# Altium schematic sheet pocopin.SchDoc
size A4
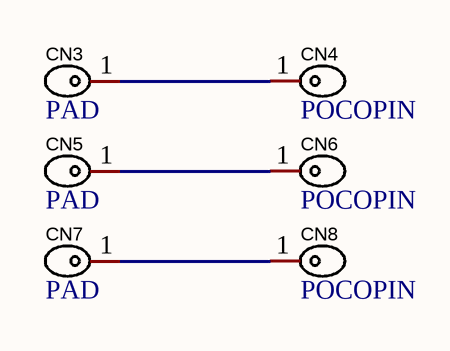
[diagram p0: pocopin.SchDoc]

## Parts
CN3  PAD  [PAD]
CN4  POCOPIN  [pocopin焊盘]
CN5  PAD  [PAD]
CN6  POCOPIN  [pocopin焊盘]
CN7  PAD  [PAD]
CN8  POCOPIN  [pocopin焊盘]

## Nets
NetCN3_1: CN3.1 CN4.1
NetCN5_1: CN5.1 CN6.1
NetCN7_1: CN7.1 CN8.1

## Library data of the parts
CN3 CN5 CN7 = PAD: Manufacturer: YIYUAN(怡远); Name: YTC1P-3015-01; Add into BOM: yes; Overall Length/Height: 4.5mm; Rated Current: 2.5A; Rated Voltage: 12V; Symbol: YTC1P-3015-01; Device: YTC1P-3015-01; LCSC Part Name: POGO PIN弹簧顶针 贴片连接器; Supplier Part: C5221293; Manufacturer Part: YTC1P-3015-01; Supplier Footprint: -; JLCPCB Part Class: Extended Part; Datasheet: https://atta.szlcsc.com/upload/public/pdf/source/20221031/BD070516233C1C93A35D01CFB419D0D5.pdf; Supplier: LCSC; Convert to PCB: yes; Type: 弹簧顶针(POGO PIN); Number of Pins: 单PIN位; Contact Material: 黄铜; Contact Plating: 金
CN4 CN6 CN8 = POCOPIN: Manufacturer: YIYUAN(怡远); Name: YTC1P-3015-01; Add into BOM: yes; Overall Length/Height: 4.5mm; Rated Current: 2.5A; Rated Voltage: 12V; Symbol: YTC1P-3015-01; Device: YTC1P-3015-01; LCSC Part Name: POGO PIN弹簧顶针 贴片连接器; Supplier Part: C5221293; Manufacturer Part: YTC1P-3015-01; Supplier Footprint: -; JLCPCB Part Class: Extended Part; Datasheet: https://atta.szlcsc.com/upload/public/pdf/source/20221031/BD070516233C1C93A35D01CFB419D0D5.pdf; Supplier: LCSC; Convert to PCB: yes; Type: 弹簧顶针(POGO PIN); Number of Pins: 单PIN位; Contact Material: 黄铜; Contact Plating: 金